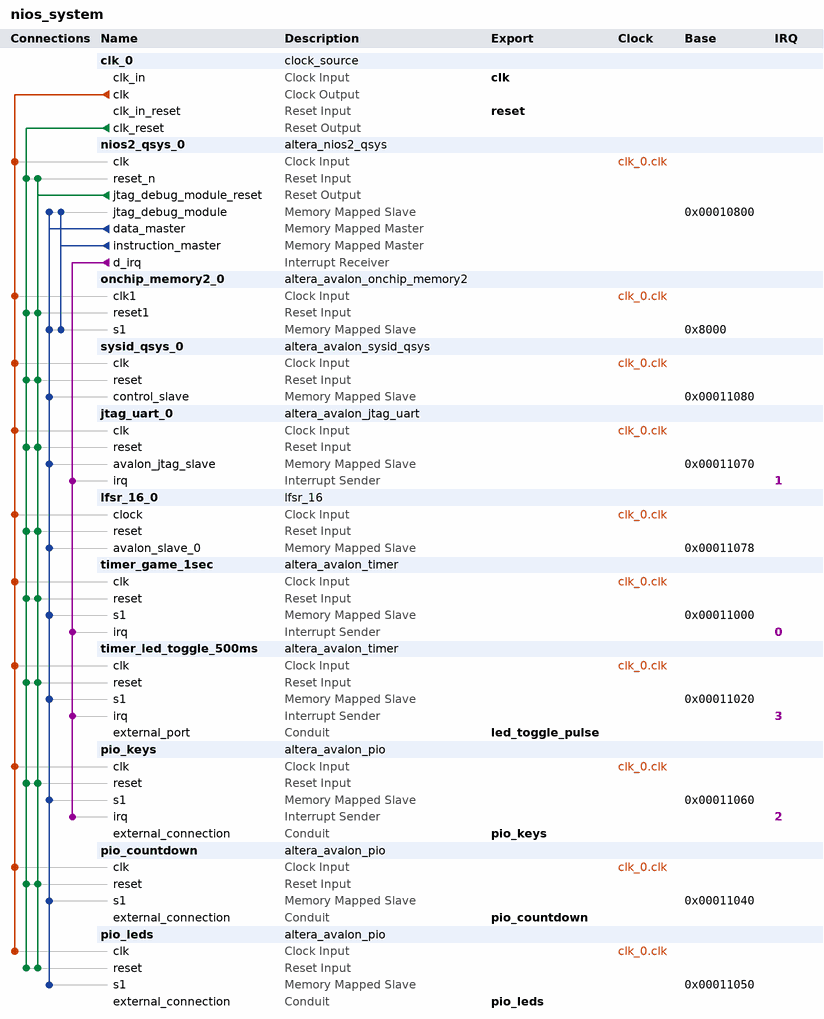
[diagram p0: system contents]
# Platform Designer (Qsys) system nios_system, Cyclone II EP2C35F672C6
# Parameters at their usual value, and those the tool derives, are not listed.
package require -exact qsys 12.0
create_system nios_system
set_project_property DEVICE_FAMILY {Cyclone II}
set_project_property DEVICE EP2C35F672C6

add_instance clk_0 clock_source 12.0
set_instance_parameter_value clk_0 clockFrequency 50000000

add_instance nios2_qsys_0 altera_nios2_qsys 12.0
set_instance_parameter_value nios2_qsys_0 muldiv_divider true
set_instance_parameter_value nios2_qsys_0 resetSlave onchip_memory2_0.s1
set_instance_parameter_value nios2_qsys_0 exceptionSlave onchip_memory2_0.s1
set_instance_parameter_value nios2_qsys_0 breakSlave nios2_qsys_0.jtag_debug_module
set_instance_parameter_value nios2_qsys_0 impl Small
set_instance_parameter_value nios2_qsys_0 icache_size 4096

add_instance onchip_memory2_0 altera_avalon_onchip_memory2 12.0
set_instance_parameter_value onchip_memory2_0 dataWidth 32
set_instance_parameter_value onchip_memory2_0 dualPort false
set_instance_parameter_value onchip_memory2_0 initMemContent true
set_instance_parameter_value onchip_memory2_0 initializationFileName onchip_memory2_0
set_instance_parameter_value onchip_memory2_0 memorySize 32768

add_instance sysid_qsys_0 altera_avalon_sysid_qsys 12.0
set_instance_parameter_value sysid_qsys_0 id 5610703

add_instance jtag_uart_0 altera_avalon_jtag_uart 12.0
set_instance_parameter_value jtag_uart_0 simInteractiveOptions INTERACTIVE_ASCII_OUTPUT

add_instance lfsr_16_0 lfsr_16 1.0

add_instance timer_game_1sec altera_avalon_timer 12.0
set_instance_parameter_value timer_game_1sec fixedPeriod true
set_instance_parameter_value timer_game_1sec period 1
set_instance_parameter_value timer_game_1sec periodUnits SEC
set_instance_parameter_value timer_game_1sec snapshot false
set_instance_parameter_value timer_game_1sec timerPreset CUSTOM

add_instance timer_led_toggle_500ms altera_avalon_timer 12.0
set_instance_parameter_value timer_led_toggle_500ms alwaysRun true
set_instance_parameter_value timer_led_toggle_500ms fixedPeriod true
set_instance_parameter_value timer_led_toggle_500ms period 0.5
set_instance_parameter_value timer_led_toggle_500ms periodUnits SEC
set_instance_parameter_value timer_led_toggle_500ms snapshot false
set_instance_parameter_value timer_led_toggle_500ms timeoutPulseOutput true
set_instance_parameter_value timer_led_toggle_500ms timerPreset CUSTOM

add_instance pio_keys altera_avalon_pio 12.0
set_instance_parameter_value pio_keys bitClearingEdgeCapReg true
set_instance_parameter_value pio_keys captureEdge true
set_instance_parameter_value pio_keys direction Input
set_instance_parameter_value pio_keys edgeType FALLING
set_instance_parameter_value pio_keys generateIRQ true
set_instance_parameter_value pio_keys irqType EDGE
set_instance_parameter_value pio_keys width 2

add_instance pio_countdown altera_avalon_pio 12.0
set_instance_parameter_value pio_countdown direction Output
set_instance_parameter_value pio_countdown width 8

add_instance pio_leds altera_avalon_pio 12.0
set_instance_parameter_value pio_leds direction Output
set_instance_parameter_value pio_leds width 2

# connections
add_connection clk_0.clk jtag_uart_0.clk clock
add_connection clk_0.clk lfsr_16_0.clock clock
add_connection clk_0.clk nios2_qsys_0.clk clock
add_connection clk_0.clk onchip_memory2_0.clk1 clock
add_connection clk_0.clk pio_countdown.clk clock
add_connection clk_0.clk pio_keys.clk clock
add_connection clk_0.clk pio_leds.clk clock
add_connection clk_0.clk sysid_qsys_0.clk clock
add_connection clk_0.clk timer_game_1sec.clk clock
add_connection clk_0.clk timer_led_toggle_500ms.clk clock
add_connection clk_0.clk_reset jtag_uart_0.reset reset
add_connection clk_0.clk_reset lfsr_16_0.reset reset
add_connection clk_0.clk_reset nios2_qsys_0.reset_n reset
add_connection clk_0.clk_reset onchip_memory2_0.reset1 reset
add_connection clk_0.clk_reset pio_countdown.reset reset
add_connection clk_0.clk_reset pio_keys.reset reset
add_connection clk_0.clk_reset pio_leds.reset reset
add_connection clk_0.clk_reset sysid_qsys_0.reset reset
add_connection clk_0.clk_reset timer_game_1sec.reset reset
add_connection clk_0.clk_reset timer_led_toggle_500ms.reset reset
add_connection nios2_qsys_0.jtag_debug_module_reset jtag_uart_0.reset reset
add_connection nios2_qsys_0.jtag_debug_module_reset lfsr_16_0.reset reset
add_connection nios2_qsys_0.jtag_debug_module_reset nios2_qsys_0.reset_n reset
add_connection nios2_qsys_0.jtag_debug_module_reset onchip_memory2_0.reset1 reset
add_connection nios2_qsys_0.jtag_debug_module_reset pio_countdown.reset reset
add_connection nios2_qsys_0.jtag_debug_module_reset pio_keys.reset reset
add_connection nios2_qsys_0.jtag_debug_module_reset pio_leds.reset reset
add_connection nios2_qsys_0.jtag_debug_module_reset sysid_qsys_0.reset reset
add_connection nios2_qsys_0.jtag_debug_module_reset timer_game_1sec.reset reset
add_connection nios2_qsys_0.jtag_debug_module_reset timer_led_toggle_500ms.reset reset
add_connection nios2_qsys_0.data_master jtag_uart_0.avalon_jtag_slave avalon
set_connection_parameter_value nios2_qsys_0.data_master/jtag_uart_0.avalon_jtag_slave baseAddress 0x00011070
add_connection nios2_qsys_0.data_master lfsr_16_0.avalon_slave_0 avalon
set_connection_parameter_value nios2_qsys_0.data_master/lfsr_16_0.avalon_slave_0 baseAddress 0x00011078
add_connection nios2_qsys_0.data_master nios2_qsys_0.jtag_debug_module avalon
set_connection_parameter_value nios2_qsys_0.data_master/nios2_qsys_0.jtag_debug_module baseAddress 0x00010800
add_connection nios2_qsys_0.data_master onchip_memory2_0.s1 avalon
set_connection_parameter_value nios2_qsys_0.data_master/onchip_memory2_0.s1 baseAddress 0x8000
add_connection nios2_qsys_0.data_master pio_countdown.s1 avalon
set_connection_parameter_value nios2_qsys_0.data_master/pio_countdown.s1 baseAddress 0x00011040
add_connection nios2_qsys_0.data_master pio_keys.s1 avalon
set_connection_parameter_value nios2_qsys_0.data_master/pio_keys.s1 baseAddress 0x00011060
add_connection nios2_qsys_0.data_master pio_leds.s1 avalon
set_connection_parameter_value nios2_qsys_0.data_master/pio_leds.s1 baseAddress 0x00011050
add_connection nios2_qsys_0.data_master sysid_qsys_0.control_slave avalon
set_connection_parameter_value nios2_qsys_0.data_master/sysid_qsys_0.control_slave baseAddress 0x00011080
add_connection nios2_qsys_0.data_master timer_game_1sec.s1 avalon
set_connection_parameter_value nios2_qsys_0.data_master/timer_game_1sec.s1 baseAddress 0x00011000
add_connection nios2_qsys_0.data_master timer_led_toggle_500ms.s1 avalon
set_connection_parameter_value nios2_qsys_0.data_master/timer_led_toggle_500ms.s1 baseAddress 0x00011020
add_connection nios2_qsys_0.instruction_master nios2_qsys_0.jtag_debug_module avalon
set_connection_parameter_value nios2_qsys_0.instruction_master/nios2_qsys_0.jtag_debug_module baseAddress 0x00010800
add_connection nios2_qsys_0.instruction_master onchip_memory2_0.s1 avalon
set_connection_parameter_value nios2_qsys_0.instruction_master/onchip_memory2_0.s1 baseAddress 0x8000
add_connection nios2_qsys_0.d_irq jtag_uart_0.irq interrupt
set_connection_parameter_value nios2_qsys_0.d_irq/jtag_uart_0.irq irqNumber 1
add_connection nios2_qsys_0.d_irq pio_keys.irq interrupt
set_connection_parameter_value nios2_qsys_0.d_irq/pio_keys.irq irqNumber 2
add_connection nios2_qsys_0.d_irq timer_game_1sec.irq interrupt
set_connection_parameter_value nios2_qsys_0.d_irq/timer_game_1sec.irq irqNumber 0
add_connection nios2_qsys_0.d_irq timer_led_toggle_500ms.irq interrupt
set_connection_parameter_value nios2_qsys_0.d_irq/timer_led_toggle_500ms.irq irqNumber 3

# exported interfaces
add_interface clk clock sink
set_interface_property clk EXPORT_OF clk_0.clk_in
add_interface reset reset sink
set_interface_property reset EXPORT_OF clk_0.clk_in_reset
add_interface led_toggle_pulse conduit end
set_interface_property led_toggle_pulse EXPORT_OF timer_led_toggle_500ms.external_port
add_interface pio_countdown conduit end
set_interface_property pio_countdown EXPORT_OF pio_countdown.external_connection
add_interface pio_leds conduit end
set_interface_property pio_leds EXPORT_OF pio_leds.external_connection
add_interface pio_keys conduit end
set_interface_property pio_keys EXPORT_OF pio_keys.external_connection

save_system nios_system.qsys
